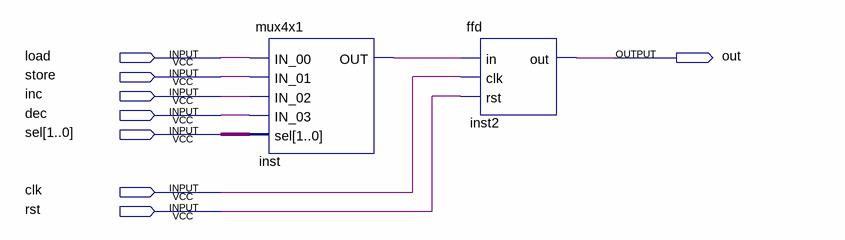
[diagram p0: schematic sheet]
// Quartus schematic ffblock.bdf as structural Verilog: 2 symbols, 8 pins
module ffblock (
  input  load,
  input  store,
  input  inc,
  input  dec,
  input  [1:0] sel,
  input  clk,
  input  rst,
  output out
);

  wire inst_out;

  mux4x1 inst (.IN_00(load), .IN_01(store), .IN_02(inc), .IN_03(dec), .sel(sel), .OUT(inst_out));
  ffd inst2 (.in(inst_out), .clk(clk), .rst(rst), .out(out));
endmodule
